# EAGLE design PWMController (EAGLE 9.6.2)
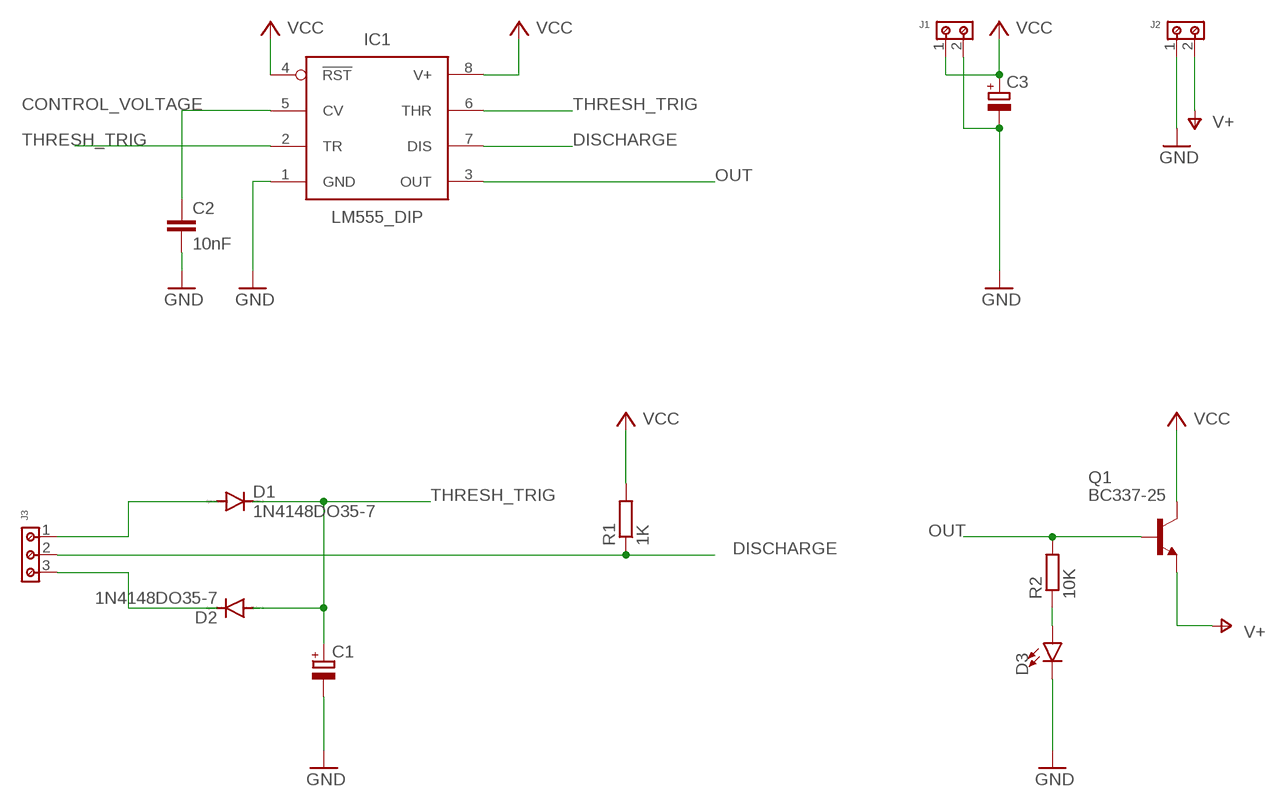
[diagram p0: schematic, sheet 1]

## Parts
C1  2.2uF  CPOL-EUE1.8-4  [E1,8-4]
C2  10nF  C_CHIP-1206(3216-METRIC)  [CAPC3216X135]
C3  100mF  CPOL-EUE1.8-4  [E1,8-4]
D1  1N4148DO35-7  [DO35-7]
D2  1N4148DO35-7  [DO35-7]
D3  LED5MM  [LED5MM]
IC1  LM555_DIP  [DIP826W53P254L959H508Q8B]
J1  691213510002  [691213510002]
J2  691213510002  [691213510002]
J3  691213510003  [691213510003]
Q1  BC337-25  [TO92]
R1  1K  R-EU_R1206  [R1206]
R2  10K  R-EU_R1206  [R1206]

## Nets
CONTROL_VOLTAGE: C2.1 IC1.5(CV)
DISCHARGE: IC1.7(DIS) J3.2 R1.1
GND: C1.- C2.2 C3.- D3.K(C) IC1.1(GND) J1.2 J2.1
N$1: D1.A J3.1
N$3: D3.A R2.1
N$4: D2.C J3.3
OUT: IC1.3(OUT) Q1.2(B) R2.2
THRESH_TRIG: C1.+ D1.C D2.A IC1.2(TR) IC1.6(THR)
V+: J2.2 Q1.1(E)
VCC: C3.+ IC1.4(!RST) IC1.8(V+) J1.1 Q1.3(C) R1.2

## Library data of the parts
C1 C3 = rcl:CPOL-EU: POLARIZED CAPACITOR, European symbol; SPICEPREFIX: C
C2 = Capacitor:C: Capacitor - Generic; CATEGORY: Capacitor
D1 D2 = diode:1N4148: DIODE high speed (Philips)
D3 = led:LED: LED OSRAM: - CHIPLED LG R971, LG N971, LY N971, LG Q971, LY Q971, LO R971, LY R971 LH N974, LH R974 LS Q976, LO Q976, LY Q976 LO Q996 - Hyper CHIPLED LW Q18S LB Q993, LB Q99A, LB R99A - SideLED LS A670, LO A670, LY A670, LG A670, LP A670 LB A673, LV A673, LT A673, LW A673 LH A674 LY A675 LS A676, LA A676, LO A676, LY A676, LW A676 LS A679, LY A679, LG A679 - Hyper Micro SIDELED® LS Y876, LA Y876, LO Y876, LY Y876 LT Y87S - SmartLED LW L88C, LW L88S LB L89C, LB L89S, LG L890 LS L89K, LO L89K, LY L89K LS L896, LA L896, LO L896, LY L896 - TOPLED LS T670, LO T670, LY T670, LG T670, LP T670 LSG T670, LSP T670, LSY T670, LOP T670, LYG T670 LG T671, LOG T671, LSG T671 LB T673, LV T673, LT T673, LW T673 LH T674 LS T676, LA T676, LO T676, LY T676, LB T676, LH T676, LSB T676, LW T676 LB T67C, LV T67C, LT T67C, LS T67K, LO T67K, LY T67K, LW E67C LS E67B, LA E67B, LO E67B, LY E67B, LB E67C, LV E67C, LT E67C LW T67C LS T679, LY T679, LG T679 LS T770, LO T770, LY T770, LG T770, LP T770 LB T773, LV T773, LT T773, LW T773 LH T774 LS E675, LA E675, LY E675, LS T675 LS T776, LA T776, LO T776, LY T776, LB T776 LHGB T686 LT T68C, LB T68C - Hyper Mini TOPLED® LB M676 - Mini TOPLED Santana® LG M470 LS M47K, LO M47K, LY M47K Source: http://www.osram.convergy.de LUXEON: - LUMILED® LXK2-PW12-R00, LXK2-PW12-S00, LXK2-PW14-U00, LXK2-PW14-V00 LXK2-PM12-R00, LXK2-PM12-S00, LXK2-PM14-U00 LXK2-PE12-Q00, LXK2-PE12-R00, LXK2-PE12-S00, LXK2-PE14-T00, LXK2-PE14-U00 LXK2-PB12-K00, LXK2-PB12-L00, LXK2-PB12-M00, LXK2-PB14-N00, LXK2-PB14-P00, LXK2-PB14-Q00 LXK2-PR12-L00, LXK2-PR12-M00, LXK2-PR14-Q00, LXK2-PR14-R00 LXK2-PD12-Q00, LXK2-PD12-R00, LXK2-PD12-S00 LXK2-PH12-R00, LXK2-PH12-S00 LXK2-PL12-P00, LXK2-PL12-Q00, LXK2-PL12-R00 Source: www.luxeon.com KINGBRIGHT: KA-3528ASYC Source: www.kingbright.com
IC1 = IC_Clock-Timing:*555: TIMER 555 General purpose precision timers NE555 : Texas Datasheet <http://www.ti.com/general/docs/suppproductinfo.tsp?distId=10&gotoUrl=http%3A%2F%2Fwww.ti.com%2Flit%2Fgpn%2Fne555>, Diodes Incorporated Datasheet <https://www.diodes.com/assets/Datasheets/NE555_SA555_NA555.pdf> LM555 Datasheet <http://www.ti.com/general/docs/suppproductinfo.tsp?distId=10&gotoUrl=http%3A%2F%2Fwww.ti.com%2Flit%2Fgpn%2Flm555> LMC555 Datasheet <http://www.ti.com/general/docs/suppproductinfo.tsp?distId=10&gotoUrl=http%3A%2F%2Fwww.ti.com%2Flit%2Fgpn%2Flmc555> ICM7555 : Maxim Integrated Datasheet <https://datasheets.maximintegrated.com/en/ds/ICM7555-ICM7556.pdf>, Renesas Electronics America Inc Datasheet <https://www.renesas.com/en-us/www/doc/datasheet/icm7555-56.pdf>; CATEGORY: IC_Clock-Timing; CURRENT-SUPPLY: 10mA; DESCRIPTION: IC OSC SINGLE TIMER 100KHZ 8-DIP; FREQUENCY: 100kHz; MANUFACTURER: Texas Instruments; MPN: LM555CN/NOPB; OPERATING_TEMP: 0°C to 70°C; PART_STATUS: Active; ROHS_COMPLIANT: ROHS3 Compliant; SUB-CATEGORY: Timer
J1 J2 = Wurth_Connectors_WR-TBL Rising Cage Clamp:691213510002: WR-TBL Serie 2135 - 5.08 mm Horizontal Entry Modular w. Rising Cage Clamp KIND PROPERTIES Pitch 5.08 mm MATERIAL PROPERTIES Insulator Material PA66 Insulator Flammability Rating UL94 V-0 Contact Material Copper Alloy Contact Plating Tin over Nickel Contact Type Stamped Terminal Screw Material Steel Terminal Screw Plating Zinc Wire Guard Material Copper Alloy GENERAL INFORMATION Operating Temperature -30 up to +120 °C Compliance ROHS & Reach ELECTRICAL PROPERTIES IR UL 14 A IR VDE 14 A Working Voltage [UL] 300 V (AC) Working Voltage [VDE] 250 V (AC) Withstanding Voltage [UL] 1600 V (AC) Withstanding Voltage [VDE] 2000 V (AC) Contact Resistance 20 mΩ MECHANICAL PROPERTIES Wire Strip Length 6 Screw M3 CERTIFICATION UL Approval E150931 VDE Approval 40021366 PACKAGING PROPERTIES Packaging Box <https://www.we-online.com/catalog/media/o32805v209%20Family_WR-TBL2_Series2135.jpg> Details see: https://www.we-online.com/catalog/en/TBL_5_08_2135_HORIZONTAL_ENTRY_MODULAR_69121351000x/ Updated by Ella Wu 2019-11-26 2019(C) Wurth Elektronik; IR-UL: 14A; IR-VDE: 14A; PART-NUMBER: 691213510002; PINS: 2; PITCH: 5.08mm; TYPE: Horizontal; WIRE: 14 to 30 (AWG) 2.08 to 0.0509 (mm²); WORKING-VOLTAGE-UL: 300V (AC); WORKING-VOLTAGE-VDE: 250V (AC)
J3 = Wurth_Connectors_WR-TBL Rising Cage Clamp:691213510003: WR-TBL Serie 2135 - 5.08 mm Horizontal Entry Modular w. Rising Cage Clamp KIND PROPERTIES Pitch 5.08 mm MATERIAL PROPERTIES Insulator Material PA66 Insulator Flammability Rating UL94 V-0 Contact Material Copper Alloy Contact Plating Tin over Nickel Contact Type Stamped Terminal Screw Material Steel Terminal Screw Plating Zinc Wire Guard Material Copper Alloy GENERAL INFORMATION Operating Temperature -30 up to +120 °C Compliance ROHS & Reach ELECTRICAL PROPERTIES IR UL 14 A IR VDE 14 A Working Voltage [UL] 300 V (AC) Working Voltage [VDE] 250 V (AC) Withstanding Voltage [UL] 1600 V (AC) Withstanding Voltage [VDE] 2000 V (AC) Contact Resistance 20 mΩ MECHANICAL PROPERTIES Wire Strip Length 6 Screw M3 CERTIFICATION UL Approval E150931 VDE Approval 40021366 PACKAGING PROPERTIES Packaging Box <https://www.we-online.com/catalog/media/o32805v209%20Family_WR-TBL2_Series2135.jpg> Details see: https://www.we-online.com/catalog/en/TBL_5_08_2135_HORIZONTAL_ENTRY_MODULAR_69121351000x/ Updated by Ella Wu 2019-11-26 2019(C) Wurth Elektronik; IR-UL: 14A; IR-VDE: 14A; PART-NUMBER: 691213510003; PINS: 3; PITCH: 5.08mm; TYPE: Horizontal; WIRE: 14 to 30 (AWG) 2.08 to 0.0509 (mm²); WORKING-VOLTAGE-UL: 300V (AC); WORKING-VOLTAGE-VDE: 250V (AC)
Q1 = transistor-npn:BC337*: NPN Transistor
R1 R2 = rcl:R-EU_: RESISTOR, European symbol; SPICEPREFIX: R

## Board
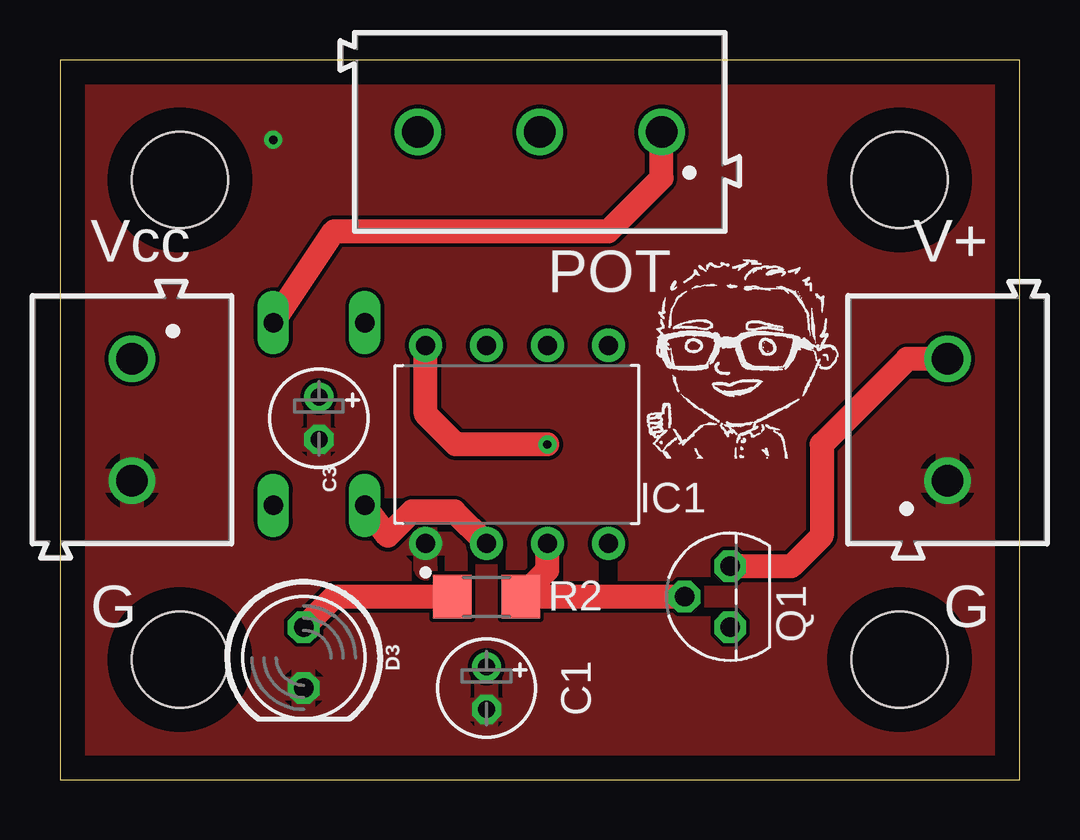
[diagram p1: board, top side]
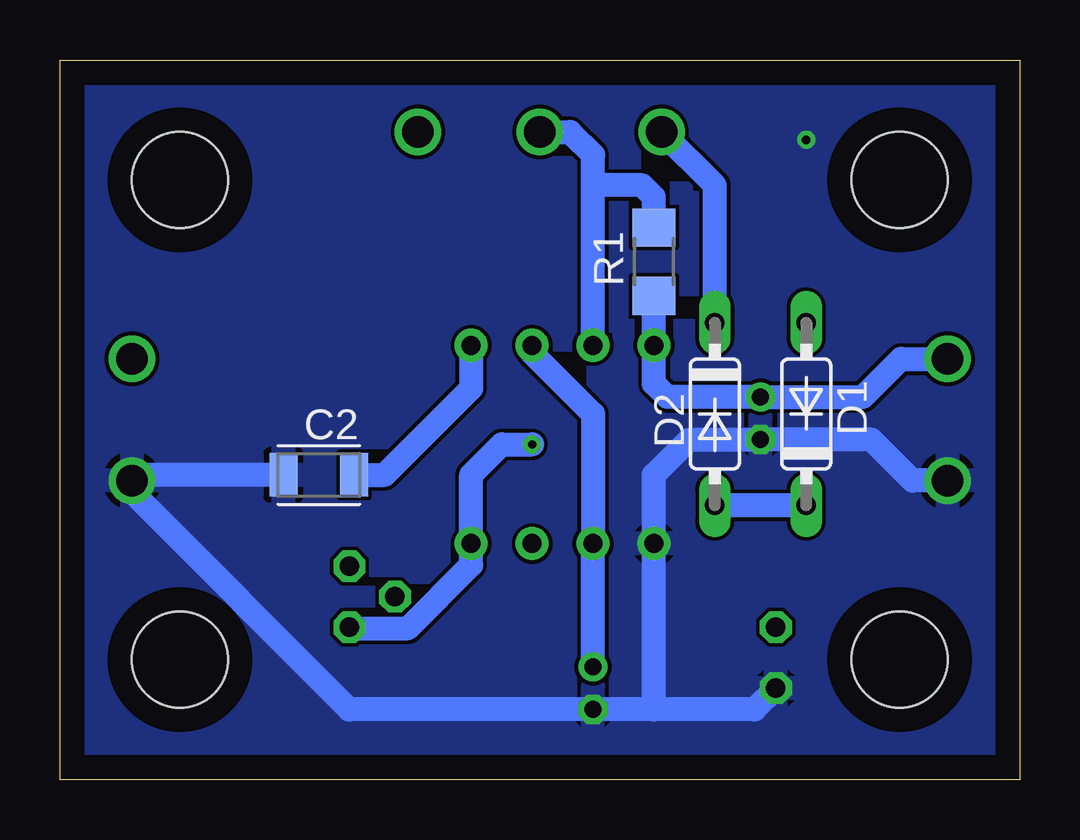
[diagram p2: board, bottom side, seen from below]

Size 40 x 30 mm. Coordinates in mm from the lower left corner, seen from the top.
Outline: 0,0 40,0 40,30 0,30 0,0
Copper layers (1*16): Top 0.035mm / dielectric 1.5mm / Bottom 0.035mm
Design rules "default": minimum track width 6mil, minimum drill 0.35mm, track to track 6mil, track to pad 6mil, pad to pad 6mil, via to via 6mil, smd to smd 6mil, copper to edge 40mil, drill to drill 6mil, minimum pad ring 10mil, minimum via ring 8mil, stop-mask expansion 4mil, vias tented up to drill 0mil, thermal gap 10mil
Holes 4 mm at 35,5 35,25 5,25 5,5

### Footprints (pad centres in the part's own frame; a part is rotated, then mirrored left to right if it is on the bottom)
E1,8-4 = drill 0.711 pad 1.168: + -0.889,0 | drill 0.711 pad 1.168 octagon: - 0.889,0
CAPC3216X135 = smd 1.165 x 1.815: 1 -1.475,0; 2 1.475,0
DO35-7 = drill 0.813 long: A 3.81,0; C -3.81,0
LED5MM = drill 0.813 octagon: A -1.27,0; K 1.27,0
DIP826W53P254L959H508Q8B = drill 0.786 pad 1.386: 1 -4.13,3.81; 2 -4.13,1.27; 3 -4.13,-1.27; 4 -4.13,-3.81; 5 4.13,-3.81; 6 4.13,-1.27; 7 4.13,1.27; 8 4.13,3.81
691213510002 = drill 1.3: 1 -2.54,0; 2 2.54,0
691213510003 = drill 1.3: 1 -5.08,0; 2 0,0; 3 5.08,0
TO92 = drill 0.813 octagon: 1 1.27,0; 2 0,1.905; 3 -1.27,0
R1206 = smd 1.6 x 1.803: 1 -1.422,0; 2 1.422,0

### Placement (x,y rotation side)
C1  17.78,3.81 270 top
C2  29.21,12.7 180 bottom
C3  10.79,15.06 270 top
D1  8.89,15.24 90 bottom
D2  12.7,15.24 270 bottom
D3  10.16,5.08 270 top
IC1  19.05,13.97 90 top
J1  3,15 270 top
J2  37,15 90 top
J3  20,27 180 top
Q1  27.94,7.62 90 top
R1  15.24,21.59 270 bottom
R2  17.78,7.62 0 top

### Tracks (layer width: path | path; a pad name or v marks a point on that pad's centre or on a via)
CONTROL_VOLTAGE
  Bottom 1: C2.1 26.46,12.7 22.86,16.3 IC1.5
DISCHARGE
  Bottom 1: IC1.7 17.78,24.78 | 17.78,24.78 17.78,26.05 18.73,27 J3.2 | R1.1 15.24,24.28 15.74,24.78 17.78,24.78
GND  (via drill 0.35)
  Bottom 1: 27.95,2.92 27.94,2.92 | 27.94,2.92 C1.- 15.24,2.92 | D3.K 11.05,2.92 15.24,2.92 | 15.24,2.92 IC1.1 15.24,12.7 13.77,14.17 C3.- 6.17,14.17 4.46,12.46 J1.2 | C2.2 37,12.7 J2.1 37,11.98 27.94,2.92
  other vias: 8.89,26.67
  pour Top: -5.08,30.48 -5.08,1.27 -1.27,-2.54 41.91,-2.54 44.45,0 45.72,1.27 45.72,31.75 -3.81,31.75
  pour Bottom: -5.08,31.75 -5.08,1.27 -3.81,0 -1.27,-2.54 44.45,-2.54 46.99,0 46.99,20.32 46.99,29.21 44.45,31.75
N$1
  Top 1: D1.A 11.43,22.86 22.86,22.86 25.08,25.08 J3.1
N$3
  Top 1: R2.1 11.43,7.62 D3.A
N$4
  Bottom 1: D2.C 12.7,24.78 J3.3
OUT
  Top 1: IC1.3 20.32,8.74 R2.2 Q1.2
THRESH_TRIG
  Top 1: D2.A 13.66,10.16 14.68,11.19 16.43,11.19 IC1.2
  Bottom 1: IC1.6 20.32,17.78 17.78,15.24 IC1.2 C1.+ | D1.C D2.A
V+
  Top 1: Q1.1 30.48,8.89 31.75,10.16 31.75,13.97 35.32,17.54 J2.2
VCC  (via drill 0.35)
  Top 1: v20.32,13.97 16.51,13.97 15.24,15.24 IC1.8
  Bottom 1: v20.32,13.97 21.59,13.97 22.86,12.7 IC1.4 22.86,8.94 25.49,6.31 27.9,6.31 Q1.3 | R1.2 IC1.8 15.24,16.51 14.68,15.95 C3.+ 6.53,15.95 4.94,17.54 J1.1

### Text on the board
tNames: Vcc | V+ | POT | G | G